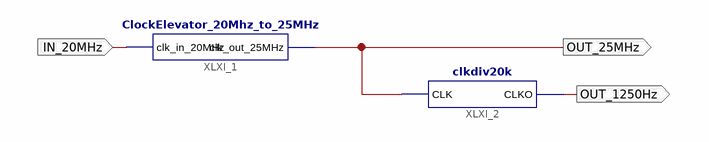
[diagram p0: schematic sheet 1]
// Xilinx ISE schematic ClockManipulator.sch (spartan6) as structural Verilog: 2 symbols, 3 ports
module ClockManipulator (
  input  IN_20MHz,
  output OUT_25MHz,
  output OUT_1250Hz
);

  ClockElevator_20Mhz_to_25MHz XLXI_1 (.clk_in_20MHz(IN_20MHz), .clk_out_25MHz(OUT_25MHz));
  clkdiv20k XLXI_2 (.CLK(OUT_25MHz), .CLKO(OUT_1250Hz));
endmodule
